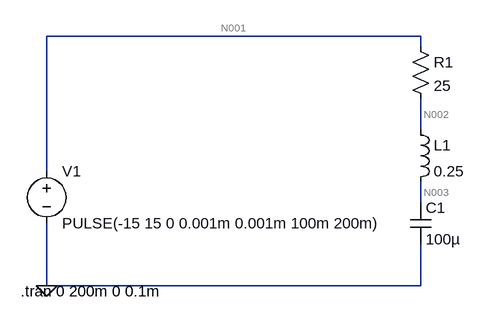
[diagram p0: schematic Schema 1.asc]
Schema 1.asc, the LTspice schematic file:
Version 4.1
SHEET 1 880 680
WIRE 656 -80 80 -80
WIRE 656 -64 656 -80
WIRE 656 64 656 16
WIRE 80 128 80 -80
WIRE 656 176 656 144
WIRE 80 304 80 208
WIRE 656 304 656 240
WIRE 656 304 80 304
FLAG 80 304 0
SYMBOL voltage 80 112 R0
SYMATTR InstName V1
SYMATTR Value PULSE(-15 15 0 0.001m 0.001m 100m 200m)
SYMBOL res 640 -80 R0
SYMATTR InstName R1
SYMATTR Value 25
SYMBOL ind 640 48 R0
SYMATTR InstName L1
SYMATTR Value 0.25
SYMBOL cap 640 176 R0
SYMATTR InstName C1
SYMATTR Value 100µ
TEXT 40 312 Left 2 !.tran 0 200m 0 0.1m

The netlist it stands for:
* Schema 1.asc
V1 N001 0 PULSE(-15 15 0 0.001m 0.001m 100m 200m)
R1 N001 N002 25
L1 N002 N003 0.25
C1 N003 0 100µ
.tran 0 200m 0 0.1m
.backanno
.end

* Results of the author's LTspice run, read from the files saved beside the schematic
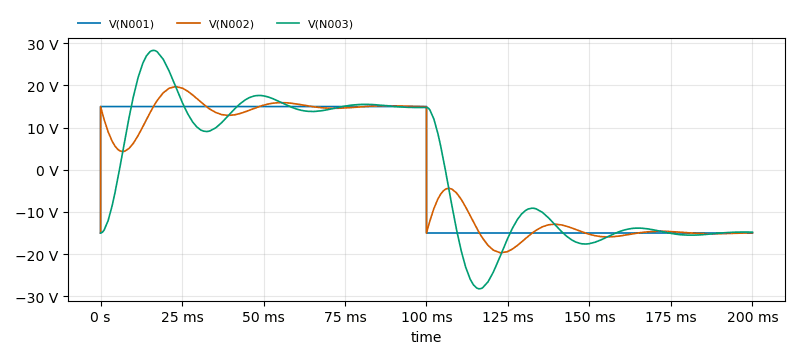
[diagram p1: Transient Analysis of Schema 1.asc, plotted from the saved traces]
* Transient Analysis, 1 run:
*   V(N001): min -15 V, max 15 V, average 150 µV, rms 15 V, last -15 V
*   V(N002): min -19.69 V, max 19.74 V, average -2.407 mV, rms 14.62 V, last -14.95 V
*   V(N003): min -28.24 V, max 28.33 V, average 18.47 µV, rms 16.08 V, last -14.8 V